# Altium schematic sheet MCU.SchDoc
size A; SheetNumber: 2; SheetTotal: 2
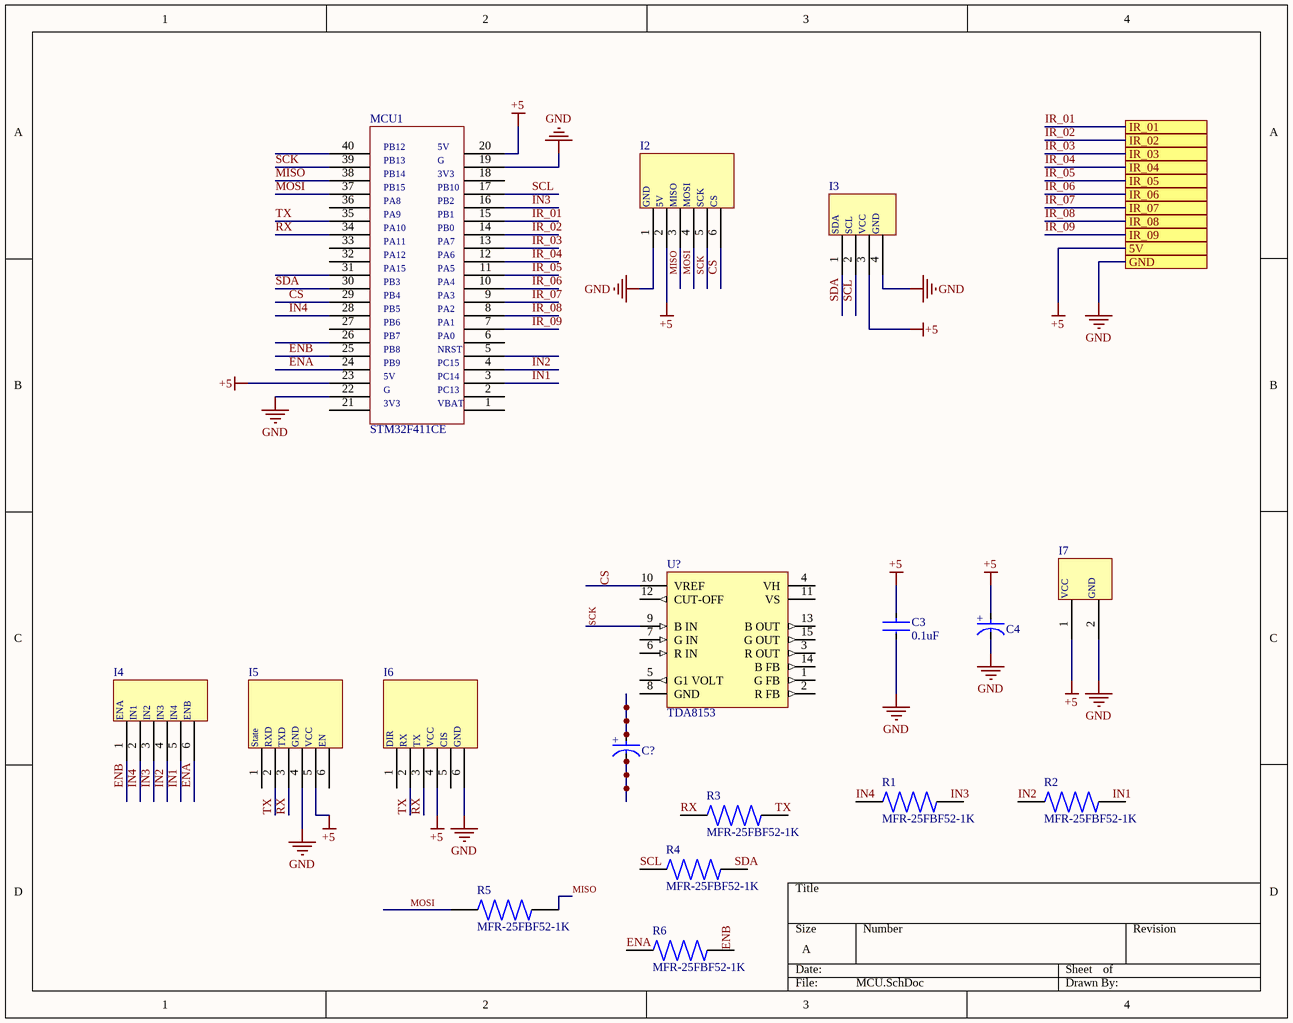
[diagram p0: MCU.SchDoc]

## Parts
C3  0.1uF  [FP-RDE0P1-MFG]
C4  ECEA1CKA101I  [FP-RAD-TH-D_6_3_0_5-L_7_1-MFG]  (value not drawn)
C?  ECEA1CKA101I  [FP-RAD-TH-D_6_3_0_5-L_7_1-MFG]  (value not drawn)
I2  SD_Mod  [HPC_1x6]  (value not drawn)
I3  I2S  [HPC_1x4]  (value not drawn)
I4  M_Driver  [HPC_1x6]  (value not drawn)
I5  HC_05  [HPC_1x6]  (value not drawn)
I6  FTDI  [HPC_1x6]  (value not drawn)
I7  (no value)  [PCBComponent_1]
MCU1  STM32F411CE  [STM32F411CE]
R1  MFR-25FBF52-1K  [RESAD1100W55L680D260]
R2  MFR-25FBF52-1K  [RESAD1100W55L680D260]
R3  MFR-25FBF52-1K  [RESAD1100W55L680D260]
R4  MFR-25FBF52-1K  [RESAD1100W55L680D260]
R5  MFR-25FBF52-1K  [RESAD1100W55L680D260]
R6  MFR-25FBF52-1K  [RESAD1100W55L680D260]
U?  TDA8153  [MULTIWAT15]

## Ports
5V (see IR_array[3A]), GND (see IR_array[3A]), IR_01 (see IR_array[3A]), IR_02 (see IR_array[3A]), IR_03 (see IR_array[3A]), IR_04 (see IR_array[3A]), IR_05 (see IR_array[3A]), IR_06 (see IR_array[3A]), IR_07 (see IR_array[3A]), IR_08 (see IR_array[3A]), IR_09 (see IR_array[3A])

## Nets
+5: C3.1 C4.2(A) ; port 5V
GND: C3.2 C4.1(C) ; port GND
CS: U?.10(VREF)
ENA: R6.1
ENB: R6.2
IN2: R2.1
IN4: R1.1
IR_01: port IR_01
IR_02: port IR_02
IR_03: port IR_03
IR_04: port IR_04
IR_05: port IR_05
IR_06: port IR_06
IR_07: port IR_07
IR_08: port IR_08
IR_09: port IR_09
MISO: R5.2
MOSI: R5.1
RX: R3.1
SCK: U?.9(B_IN)
SCL: R4.1

Not connected (* = marked no-connect by the designer): C? 1(C) 2(A); I2 1(GND) 2(5V) 3(MISO) 4(MOSI) 5(SCK) 6(CS); I3 1(SDA) 2(SCL) 3(VCC) 4(GND); I4 1 2 3 4 5 6; I5 1(State) 2(RXD) 3(TXD) 4(GND) 5(VCC) 6(EN); I6 1(DIR) 2(RX) 3(TX) 4(VCC) 5(CIS) 6(GND); I7 1(VCC) 2(GND); MCU1 1(VBAT) 2(VBAT) 3(VBAT) 4(VBAT) 5(VBAT) 6(VBAT) 7(VBAT) 8(VBAT) 9(VBAT) 10(VBAT) 11(VBAT) 12(VBAT) 13(VBAT) 14(VBAT) 15(VBAT) 16(VBAT) 17(VBAT) 18(VBAT) 19(VBAT) 20(VBAT) 21(3v3) 22(G) 23(5V) 24(PB9) 25(PB8) 26(PB7) 27(PB6) 28(PB5) 29(PB4) 30(PB3) 31(PA15) 32(PA12) 33(PA11) 34(PA10) 35(PA9) 36(PA8) 37(PB15) 38(PB14) 39(PB13) 40(PB12); R1 2; R2 2; R3 2; R4 2; U? 1(G_FB) 2(R_FB) 3(R_OUT) 4(VH) 5(G1_VOLT) 6(R_IN) 7(G_IN) 8(GND) 11(VS) 12(CUT-OFF) 13(B_OUT) 14(B_FB) 15(G_OUT)

## Notes on the sheet
- Labels drawn without touching a wire or pin: IN1, IN3, SDA, TX
- (in symbol CMP-05427-001316-1) +
- (in symbol M_Driver) ENA; IN1; IN2; IN3; IN4; ENB
- (in symbol STM32F411CE) 3V3; PB10; PB2; PB1; PB0; PA7; PA6; PA5; PA4; PA3; PA2; PA1; PA0; NRST; PC15; PC14; PC13

## Library data of the parts
C3 = CMP-06035-046728-1: Ceramic Capacitor 100nF ±10% 25V X7R Radial; Lead Diameter: 0.5mm; Termination: Radial; Min Operating Temperature: -55°C; Max Operating Temperature: 125°C; Height: 3.5mm; Mount: Through Hole; Voltage Rating (DC): 25V; Width: 3.5mm; Dielectric: X7R; Height - Seated (Max): 0.236inch; Voltage Rating: 25V; Length: 0.197inch; Lead Free: Lead Free; Lead Pitch: 0.098inch; Case/Package: Radial; Tolerance: 10%; Packaging: Tape and Reel; Capacitance: 100nF; Resistor Type: Ceramic; Package Quantity: 2000
C4 C? = CMP-05427-001316-1: Aluminum Electrolytic Capacitors (Radial Lead Type) 100uF ±20% 16V; Life (Hours): 1000Hour; Lead Diameter: 0.45mm; Polarity: Polar; Ripple Current: 91mA; Series: KA; Packaging: Tape and Reel; Voltage Rating: 16V; Voltage Rating (DC): 16V; Min Operating Temperature: -40°C; Lead Pitch: 2.5mm; Mount: Through Hole; Height - Seated (Max): 0.315inch; Package Quantity: 2000; Length: 7mm; Termination: Radial; Voltage: 16V; Diameter: 6.3mm; Height: 7mm; Radiation Hardening: No; RoHS Compliant: Yes; Tolerance: 20%; Capacitance: 100uF; Case/Package: Radial; Max Operating Temperature: 85°C
I7 = Component_1
R1-R6 = MFR-25FBF52-1K: 1.07 kOhms Â±1% 0.25W, 1/4W Through Hole Resistor Axial - Metal Film; MF: Yageo; Value: *; SnapEDA_Link: https://www.snapeda.com/parts/MFR-25FBF52-1K/Yageo/view-part/?ref=snap; Purchase-URL: https://pricing.snapeda.com/search/part/MFR-25FBF52-1K/?ref=eda; Availability: In Stock; Price: None; Package: Axial Yageo; Check_prices: https://www.snapeda.com/parts/MFR-25FBF52-1K/Yageo/view-part/?ref=eda; MP: MFR-25FBF52-1K
U? = TDA8153: RGB Video Output Amplifier; Published: 24-Aug-2001; LatestRevisionDate: 17-Jul-2002; LatestRevisionNote: Re-released for DXP Platform.; DatasheetVersion: Jan-1993; PackageReference: MULTIWAT15; Publisher: Altium Limited; PackageDescription: TO, Thru-Hole, Vertical, Heatsink Mounted; 15 Bent Staggered Leads; Pitch 1.27 mm; ComponentLink1Description: Manufacturer Link; ComponentLink1URL: http://www.st.com/